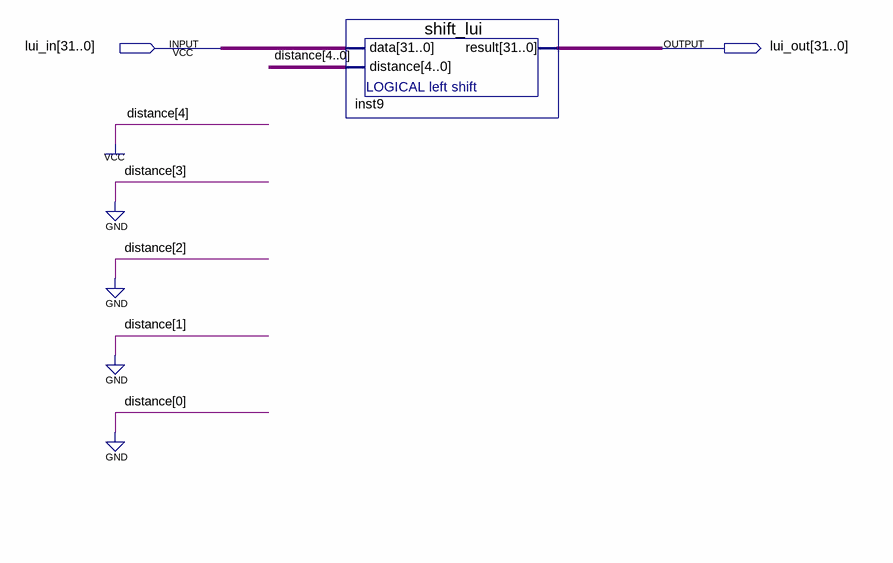
[diagram p0: schematic sheet]
// Quartus schematic lui_result.bdf as structural Verilog: 1 symbols, 2 pins
module lui_result (
  input  [31:0] lui_in,
  output [31:0] lui_out
);

  shift_lui inst9 (.data(lui_in), .distance(5'b10000), .result(lui_out));
endmodule
